# Altium schematic sheet bot_aux.SchDoc
size A4; SheetNumber: 3; SheetTotal: 8
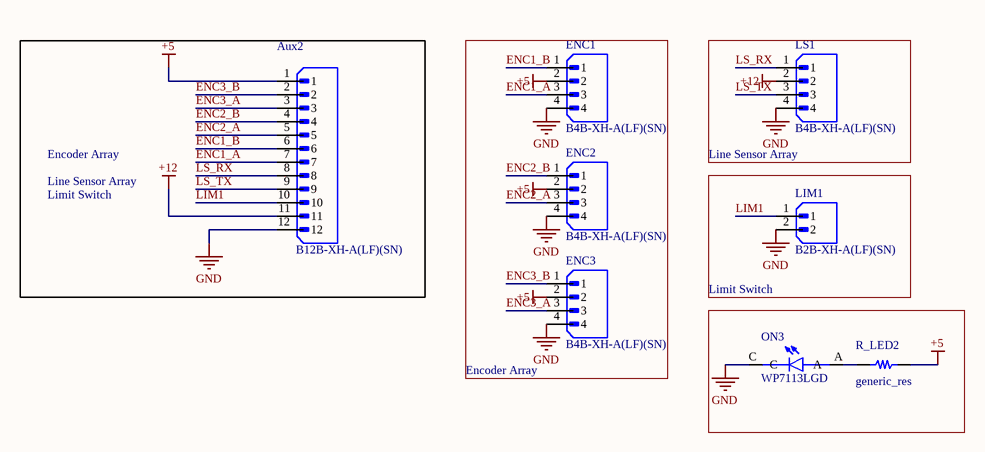
[diagram p0: bot_aux.SchDoc]

## Parts
Aux2  B12B-XH-A(LF)(SN)  [JST_B12B-XH-A(LF)(SN)]
ENC1  B4B-XH-A(LF)(SN)  [JST_B4B-XH-A(LF)(SN)]
ENC2  B4B-XH-A(LF)(SN)  [JST_B4B-XH-A(LF)(SN)]
ENC3  B4B-XH-A(LF)(SN)  [JST_B4B-XH-A(LF)(SN)]
LIM1  B2B-XH-A(LF)(SN)  [JST_B2B-XH-A(LF)(SN)]
LS1  B4B-XH-A(LF)(SN)  [JST_B4B-XH-A(LF)(SN)]
ON3  WP7113LGD  [LED_WP7113LGD]
R_LED2  generic_res  [generic_res_footprint]

## Blocks framed on the sheet
Encoder Array: ENC1-ENC3
Line Sensor Array: LS1
Limit Switch: LIM1

## Nets
+5: Aux2.1 ENC1.2 ENC2.2 ENC3.2 R_LED2.2
+12: Aux2.11 LS1.2
GND: Aux2.12 ENC1.4 ENC2.4 ENC3.4 LIM1.2 LS1.4 ON3.C
ENC1_A: Aux2.7 ENC1.3
ENC1_B: Aux2.6 ENC1.1
ENC2_A: Aux2.5 ENC2.3
ENC2_B: Aux2.4 ENC2.1
ENC3_A: Aux2.3 ENC3.3
ENC3_B: Aux2.2 ENC3.1
LIM1: Aux2.10 LIM1.1
LS_RX: Aux2.8 LS1.1
LS_TX: Aux2.9 LS1.3
NetON3_A: ON3.A R_LED2.1

## Notes on the sheet
- Line Sensor Array
- Encoder Array
- Limit Switch

## Library data of the parts
Aux2 = CMP-398-000513-1: Connector Header Through Hole 12 position 0.098 (2.50mm); MF: JST Sales; Package: None; SnapEDA_Link: https://www.snapeda.com/parts/B12B-XH-A(LF)(SN)/JST+Sales+America+Inc./view-part/?ref=snap; Source: B12B-XH-A(LF)(SN).SchLib; Check_prices: https://www.snapeda.com/parts/B12B-XH-A(LF)(SN)/JST+Sales+America+Inc./view-part/?ref=eda; Value: *; Design Item ID: B12B-XH-A(LF)(SN); MP: B12B-XH-A(LF)(SN); Pin Count: 12; Component Type: Standard
ENC1-ENC3 LS1 = CMP-328-000000-1: Connector Header Through Hole 4 position 0.098 (2.50mm); MF: JST Sales; Pin Count: 4; Value: *; Check_prices: https://www.snapeda.com/parts/B4B-XH-A(LF)(SN)/JST+Sales+America+Inc./view-part/?ref=eda; SnapEDA_Link: https://www.snapeda.com/parts/B4B-XH-A(LF)(SN)/JST+Sales+America+Inc./view-part/?ref=snap; MP: B4B-XH-A(LF)(SN); Source: B4B-XH-A(LF)(SN).SchLib; Package: None; Component Type: Standard; Design Item ID: B4B-XH-A(LF)(SN)
LIM1 = CMP-332-000000-1: Connector Header Through Hole 2 position 0.098 (2.50mm); MF: JST Sales America Inc.; Component Type: Standard; Value: *; Check_prices: https://www.snapeda.com/parts/B2B-XH-A(LF)(SN)/JST+Sales+America+Inc./view-part/?ref=eda; Package: None; MP: B2B-XH-A(LF)(SN); SnapEDA_Link: https://www.snapeda.com/parts/B2B-XH-A(LF)(SN)/JST+Sales+America+Inc./view-part/?ref=snap; Pin Count: 2; Source: B2B-XH-A(LF)(SN).SchLib; Design Item ID: B2B-XH-A(LF)(SN)
ON3 = CMP-352-000000-1: Green 568nm LED Indication - Discrete 1.9V Radial; MF: Kingbright; Value: *; Component Type: Standard; Design Item ID: WP7113LGD; Package: Radial Kingbright; Price: None; Source: WP7113LGD.SchLib; SnapEDA_Link: https://www.snapeda.com/parts/WP7113LGD/Kingbright/view-part/?ref=snap; Check_prices: https://www.snapeda.com/parts/WP7113LGD/Kingbright/view-part/?ref=eda; Pin Count: 2; Availability: In Stock; Purchase-URL: https://pricing.snapeda.com/search/part/WP7113LGD/?ref=eda; MP: WP7113LGD
R_LED2 = CMP-340-000000-2: Generic through hole resistor